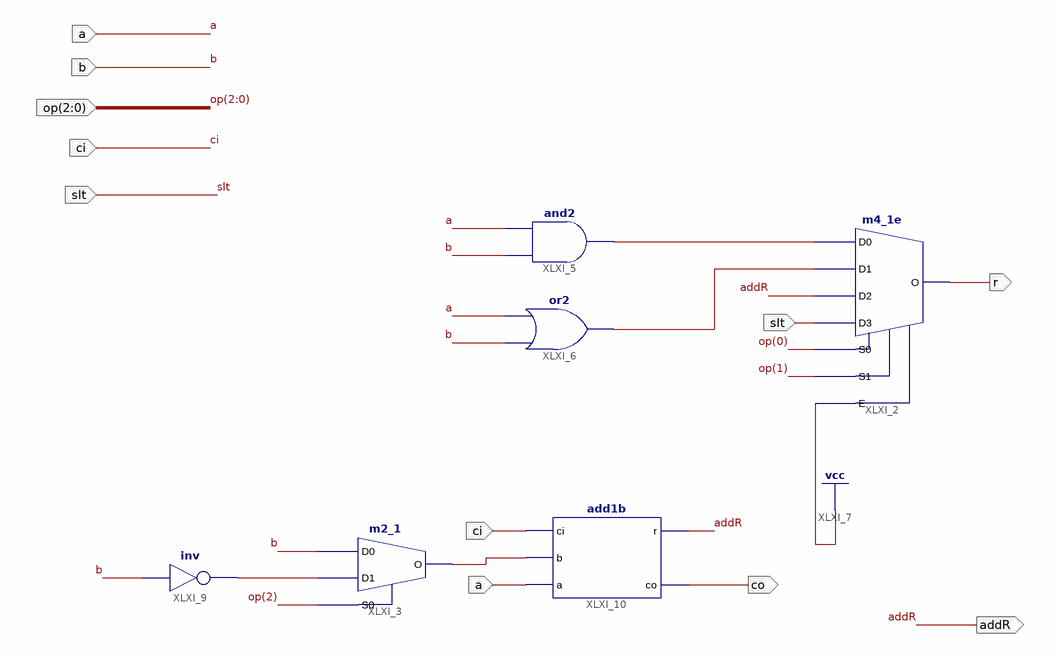
[diagram p0: schematic sheet 1]
// Xilinx ISE schematic alu_1b.sch (spartan3e) as structural Verilog: 6 symbols, 8 ports
module alu_1b (
  input  a,
  input  b,
  input  [2:0] op,
  input  ci,
  input  slt,
  output addR,
  output co,
  output r
);

  wire XLXN_1, XLXN_2, XLXN_25, XLXN_27;

  m4_1e XLXI_2 (.D0(XLXN_1), .D1(XLXN_2), .D2(addR), .D3(slt), .E(1'b1), .S0(op[0]), .S1(op[1]), .O(r));
  m2_1 XLXI_3 (.D0(b), .D1(XLXN_25), .S0(op[2]), .O(XLXN_27));
  and XLXI_5 (XLXN_1, b, a);
  or XLXI_6 (XLXN_2, b, a);
  not XLXI_9 (XLXN_25, b);
  add1b XLXI_10 (.ci(ci), .b(XLXN_27), .a(a), .r(addR), .co(co));
endmodule
